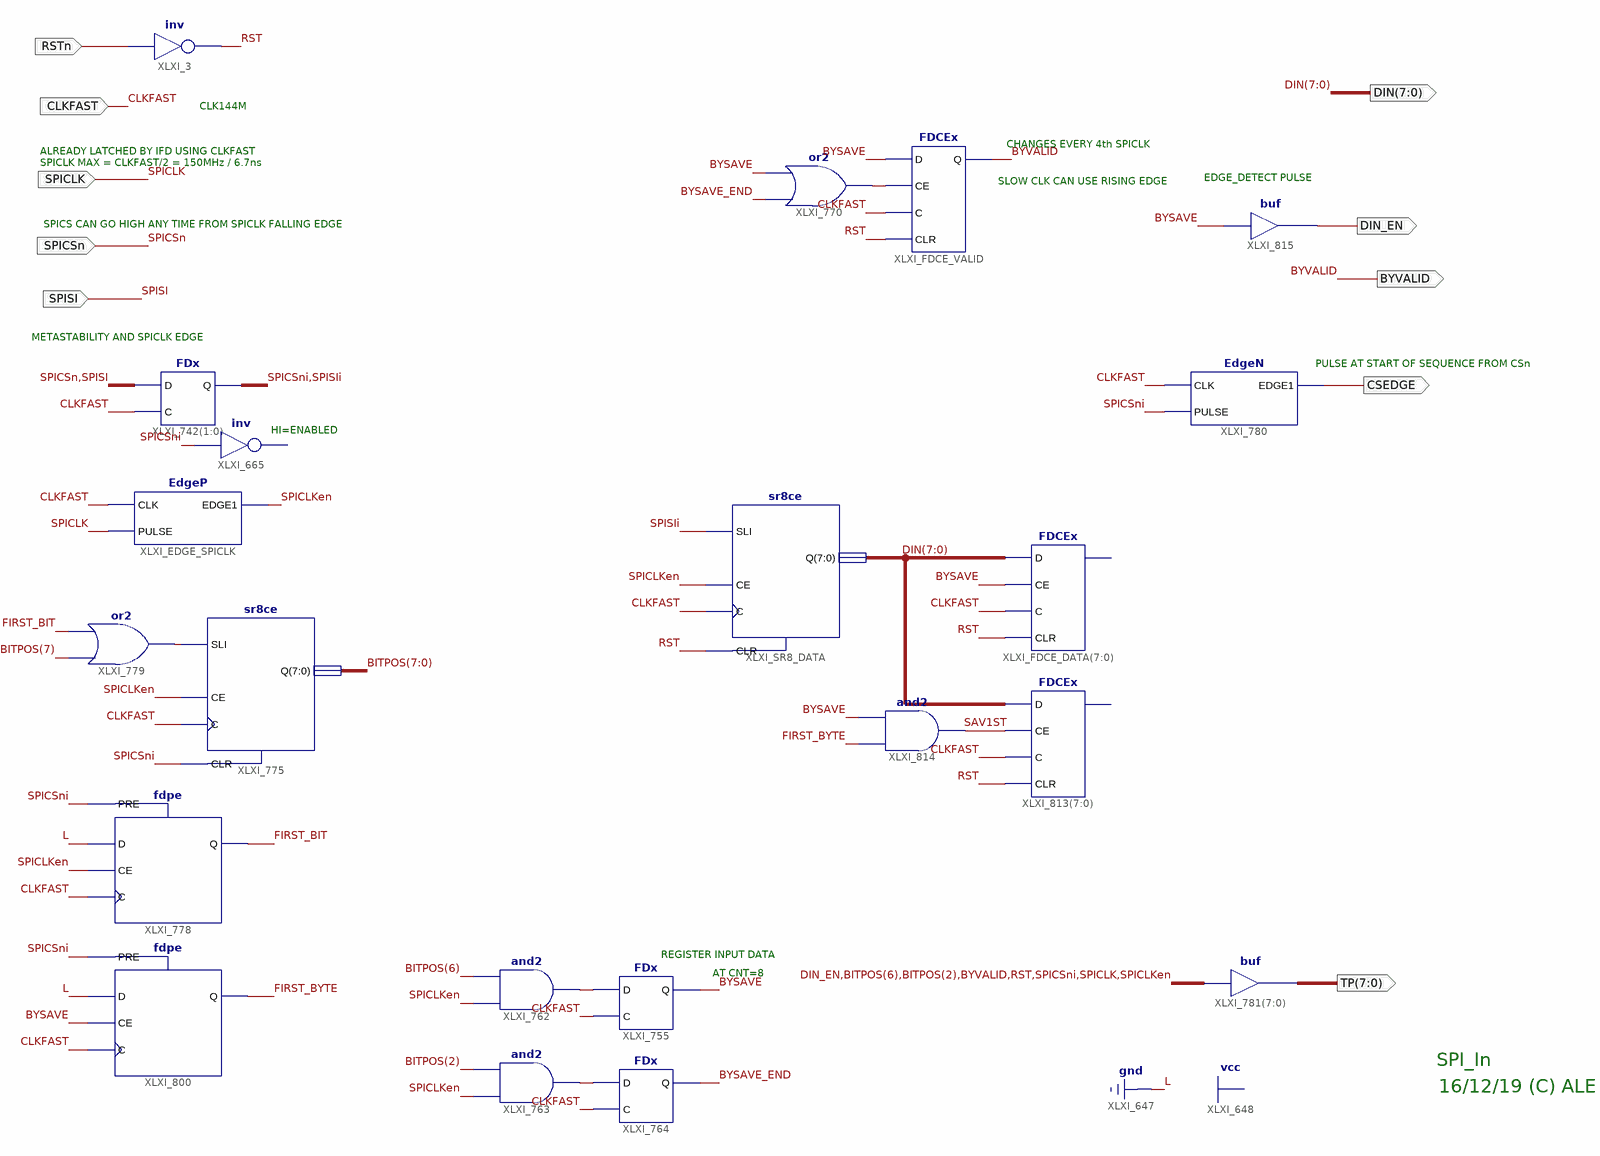
[diagram p0: schematic sheet 1]
// Xilinx ISE schematic SPI_In.sch (spartan3e) as structural Verilog: 21 symbols, 10 ports
module SPI_In (
  input  SPICSn,
  input  SPICLK,
  input  SPISI,
  input  CLKFAST,
  input  RSTn,
  output [7:0] TP,
  output DIN_EN,
  output BYVALID,
  output CSEDGE,
  output [7:0] DIN
);

  wire BYSAVE, BYSAVE_END, FIRST_BIT, FIRST_BYTE, RST, SAV1ST, SPICLKen, SPICSni, SPISIi, XLXN_366, XLXN_371,
       XLXN_386, XLXN_420;
  wire [7:0] BITPOS;

  not XLXI_3 (RST, RSTn);
  FDx XLXI_742[1:0] (.C(CLKFAST), .D({SPICSn, SPISI}), .Q({SPICSni, SPISIi}));
  EdgeP XLXI_EDGE_SPICLK (.CLK(CLKFAST), .EDGE1(SPICLKen), .PULSE(SPICLK));
  // inv XLXI_665 has open pins: I=SPICSni, O=open
  and XLXI_763 (XLXN_371, SPICLKen, BITPOS[2]);
  FDx XLXI_764 (.C(CLKFAST), .D(XLXN_371), .Q(BYSAVE_END));
  and XLXI_762 (XLXN_366, SPICLKen, BITPOS[6]);
  FDx XLXI_755 (.C(CLKFAST), .D(XLXN_366), .Q(BYSAVE));
  sr8ce XLXI_775 (.C(CLKFAST), .CE(SPICLKen), .CLR(SPICSni), .SLI(XLXN_420), .Q(BITPOS));
  or XLXI_779 (XLXN_420, BITPOS[7], FIRST_BIT);
  assign TP = {DIN_EN, BITPOS[6], BITPOS[2], BYVALID, RST, SPICSni, SPICLK, SPICLKen};  // buf XLXI_781[7..0], 8 bits wide
  fdpe XLXI_778 (.C(CLKFAST), .CE(SPICLKen), .D(1'b0), .PRE(SPICSni), .Q(FIRST_BIT));
  fdpe XLXI_800 (.C(CLKFAST), .CE(BYSAVE), .D(1'b0), .PRE(SPICSni), .Q(FIRST_BYTE));
  or XLXI_770 (XLXN_386, BYSAVE_END, BYSAVE);
  FDCEx XLXI_FDCE_VALID (.C(CLKFAST), .CE(XLXN_386), .CLR(RST), .D(BYSAVE), .Q(BYVALID));
  EdgeN XLXI_780 (.CLK(CLKFAST), .EDGE1(CSEDGE), .PULSE(SPICSni));
  FDCEx XLXI_FDCE_DATA[7:0] (.C(CLKFAST), .CE(BYSAVE), .CLR(RST), .D(DIN));  // open: Q
  sr8ce XLXI_SR8_DATA (.C(CLKFAST), .CE(SPICLKen), .CLR(RST), .SLI(SPISIi), .Q(DIN));
  FDCEx XLXI_813[7:0] (.C(CLKFAST), .CE(SAV1ST), .CLR(RST), .D(DIN));  // open: Q
  and XLXI_814 (SAV1ST, FIRST_BYTE, BYSAVE);
  buf XLXI_815 (DIN_EN, BYSAVE);

  // Notes on the sheet:
  //   CLK144M
  //   CHANGES EVERY 4th SPICLK
  //   ALREADY LATCHED BY IFD USING CLKFAST
  //   SPICLK MAX = CLKFAST/2 = 150MHz / 6.7ns
  //   EDGE_DETECT PULSE
  //   SLOW CLK CAN USE RISING EDGE
  //   SPICS CAN GO HIGH ANY TIME FROM SPICLK FALLING EDGE
  //   METASTABILITY AND SPICLK EDGE
  //   PULSE AT START OF SEQUENCE FROM CSn
  //   HI=ENABLED
  //   REGISTER INPUT DATA
  //   AT CNT=8
  //   SPI_In
  //   16/12/19 (C) ALE
endmodule
